# Altium schematic sheet 8X8PWM.SchDoc: 8 X 8 - bit PWM Driver
size B; DocumentNumber: 2; SheetNumber: 2; SheetTotal: 3; Address1: L3, 12a Rodborough Rd; Address2: Frenchs Forest; Address3: NSW; Address4: Australia 2086; Organization: Altium Limited
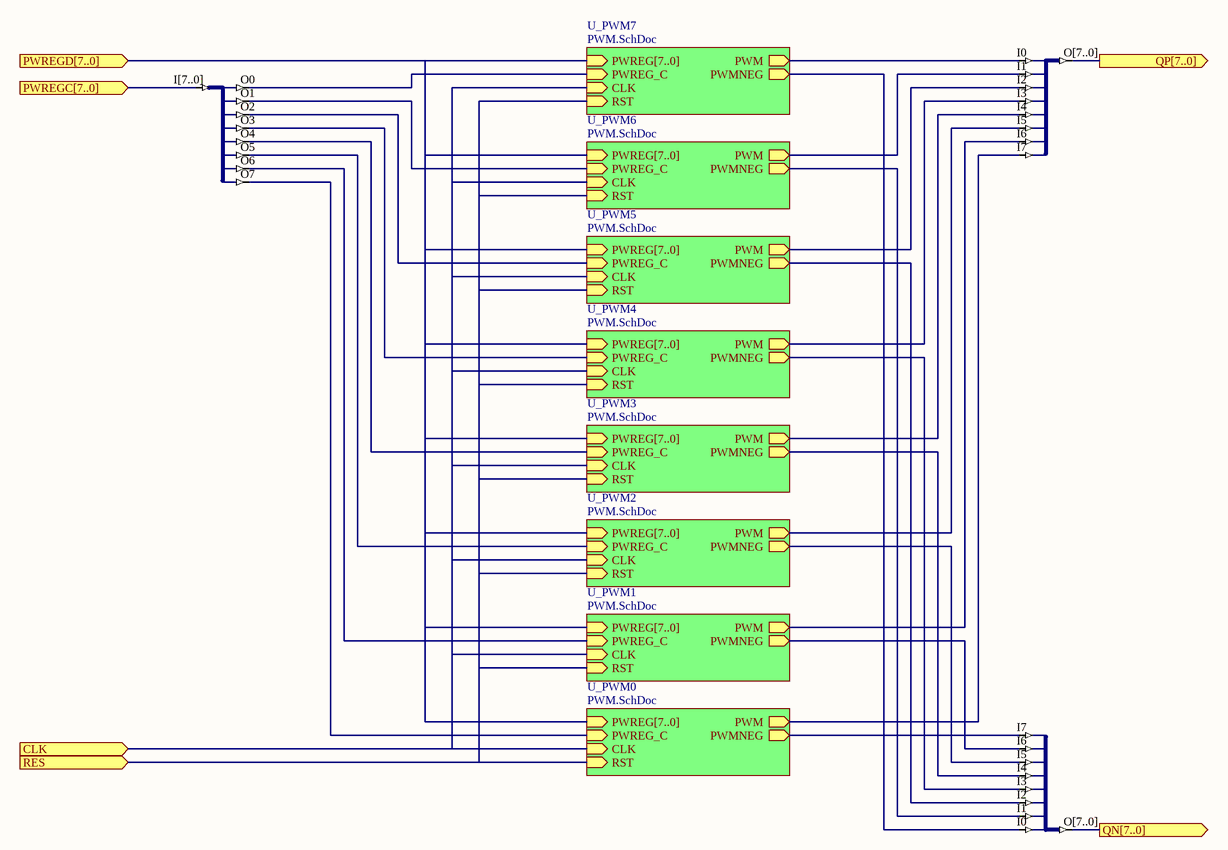
[diagram p0: 8X8PWM.SchDoc]

## Parts
UJB1  J8S_8B  (value not drawn)
UJB2  J8S_8B  (value not drawn)
UJB3  J8B_8S  (value not drawn)

## Sub-sheets
U_PWM0 = PWM.SchDoc: PWM (out), PWMNEG (out), PWREG[7..0] (in), PWREG_C (in), CLK (in), RST (in)
U_PWM1 = PWM.SchDoc: PWM (out), PWMNEG (out), PWREG[7..0] (in), PWREG_C (in), CLK (in), RST (in)
U_PWM2 = PWM.SchDoc: PWM (out), PWMNEG (out), PWREG[7..0] (in), PWREG_C (in), CLK (in), RST (in)
U_PWM3 = PWM.SchDoc: PWM (out), PWMNEG (out), PWREG[7..0] (in), PWREG_C (in), CLK (in), RST (in)
U_PWM4 = PWM.SchDoc: PWM (out), PWMNEG (out), PWREG[7..0] (in), PWREG_C (in), CLK (in), RST (in)
U_PWM5 = PWM.SchDoc: PWM (out), PWMNEG (out), PWREG[7..0] (in), PWREG_C (in), CLK (in), RST (in)
U_PWM6 = PWM.SchDoc: PWM (out), PWMNEG (out), PWREG[7..0] (in), PWREG_C (in), CLK (in), RST (in)
U_PWM7 = PWM.SchDoc: PWM (out), PWMNEG (out), PWREG[7..0] (in), PWREG_C (in), CLK (in), RST (in)

## Ports
CLK (in), PWREGC[7..0] (in), PWREGD[7..0] (in), QN[7..0] (out), QP[7..0] (out), RES (in)

## Nets
CLK: port CLK, sheet U_PWM6/CLK, sheet U_PWM4/CLK, sheet U_PWM5/CLK, sheet U_PWM7/CLK, sheet U_PWM0/CLK, sheet U_PWM1/CLK, sheet U_PWM2/CLK, sheet U_PWM3/CLK
PWREGC[7..0]: UJB3.I[7..0] ; port PWREGC[7..0]
QN[7..0]: UJB2.O[7..0] ; port QN[7..0]
QP[7..0]: UJB1.O[7..0] ; port QP[7..0]
RES: port RES, sheet U_PWM6/RST, sheet U_PWM4/RST, sheet U_PWM5/RST, sheet U_PWM7/RST, sheet U_PWM0/RST, sheet U_PWM1/RST, sheet U_PWM2/RST, sheet U_PWM3/RST
NetUJB1_I0: UJB1.I0 ; sheet U_PWM7/PWM
NetUJB1_I1: UJB1.I1 ; sheet U_PWM6/PWM
NetUJB1_I2: UJB1.I2 ; sheet U_PWM5/PWM
NetUJB1_I3: UJB1.I3 ; sheet U_PWM4/PWM
NetUJB1_I4: UJB1.I4 ; sheet U_PWM3/PWM
NetUJB1_I5: UJB1.I5 ; sheet U_PWM2/PWM
NetUJB1_I6: UJB1.I6 ; sheet U_PWM1/PWM
NetUJB1_I7: UJB1.I7 ; sheet U_PWM0/PWM
NetUJB2_I0: UJB2.I0 ; sheet U_PWM7/PWMNEG
NetUJB2_I1: UJB2.I1 ; sheet U_PWM6/PWMNEG
NetUJB2_I2: UJB2.I2 ; sheet U_PWM5/PWMNEG
NetUJB2_I3: UJB2.I3 ; sheet U_PWM4/PWMNEG
NetUJB2_I4: UJB2.I4 ; sheet U_PWM3/PWMNEG
NetUJB2_I5: UJB2.I5 ; sheet U_PWM2/PWMNEG
NetUJB2_I6: UJB2.I6 ; sheet U_PWM1/PWMNEG
NetUJB2_I7: UJB2.I7 ; sheet U_PWM0/PWMNEG
NetUJB3_O0: UJB3.O0 ; sheet U_PWM7/PWREG_C
NetUJB3_O1: UJB3.O1 ; sheet U_PWM6/PWREG_C
NetUJB3_O2: UJB3.O2 ; sheet U_PWM5/PWREG_C
NetUJB3_O3: UJB3.O3 ; sheet U_PWM4/PWREG_C
NetUJB3_O4: UJB3.O4 ; sheet U_PWM3/PWREG_C
NetUJB3_O5: UJB3.O5 ; sheet U_PWM2/PWREG_C
NetUJB3_O6: UJB3.O6 ; sheet U_PWM1/PWREG_C
NetUJB3_O7: UJB3.O7 ; sheet U_PWM0/PWREG_C

## Buses and harness runs
bus port PWREGD[7..0] = sheet U_PWM0/PWREG[7..0] = sheet U_PWM1/PWREG[7..0] = sheet U_PWM2/PWREG[7..0] = sheet U_PWM3/PWREG[7..0] = sheet U_PWM4/PWREG[7..0] = sheet U_PWM5/PWREG[7..0] = sheet U_PWM6/PWREG[7..0] = sheet U_PWM7/PWREG[7..0]

## Notes on the sheet
- Title
- Size:
- Date:
- B
- Number:
- Time:
- Revision:
- Sheet
- of
- File:

## Library data of the parts
UJB1 UJB2 = J8S_8B: 8 Single pin inputs to single 8-Bit output bus; FunctionalClass: Bus Joiner; PortSize: 8; ArchiveName: GENERIC; VHDLIB_SIM: GENERIC_LIB; Published: 29-Jan-2004; Publisher: Altium Limited; LastRevisionNo: 1.00.00; HelpURL: CR0118 FPGA Generic Library Guide.pdf#page=305
UJB3 = J8B_8S: 8-Bit input bus to 8 single pin outputs; FunctionalClass: Bus Joiner; PortSize: 8; ArchiveName: GENERIC; VHDLIB_SIM: GENERIC_LIB; Published: 29-Jan-2004; Publisher: Altium Limited; LastRevisionNo: 1.00.00; HelpURL: CR0118 FPGA Generic Library Guide.pdf#page=303